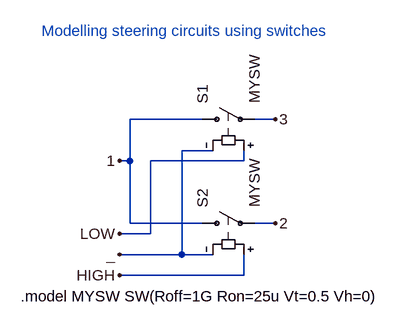
[diagram p0: schematic myspdt.asc]
myspdt.asc, the LTspice schematic file:
Version 4
SHEET 1 880 680
WIRE 144 112 32 112
WIRE 256 112 224 112
WIRE 160 160 112 160
WIRE 32 176 32 112
WIRE 32 176 16 176
WIRE 208 176 208 160
WIRE 208 176 64 176
WIRE 32 272 32 176
WIRE 144 272 32 272
WIRE 256 272 224 272
WIRE 64 288 64 176
WIRE 64 288 16 288
WIRE 112 320 112 160
WIRE 112 320 16 320
WIRE 160 320 112 320
WIRE 208 352 208 320
WIRE 208 352 16 352
FLAG 16 176 1
FLAG 16 352 HIGH
FLAG 16 320 _
FLAG 256 272 2
FLAG 256 112 3
FLAG 16 288 LOW
SYMBOL sw 128 112 R270
SYMATTR InstName S1
SYMATTR Value MYSW
SYMBOL sw 128 272 R270
SYMATTR InstName S2
SYMATTR Value MYSW
TEXT -136 384 Left 2 !.model MYSW SW(Roff=1G Ron=25u Vt=0.5 Vh=0)
TEXT -104 -24 Left 2 ;Modelling steering circuits using switches

The netlist it stands for:
* myspdt.asc
S1 1 3 LOW _ MYSW
S2 1 2 HIGH _ MYSW
.model MYSW SW(Roff=1G Ron=25u Vt=0.5 Vh=0)
* Modelling steering circuits using switches
.backanno
.end